# EAGLE design Ivy Sensor Shield (EAGLE 7.2.0)
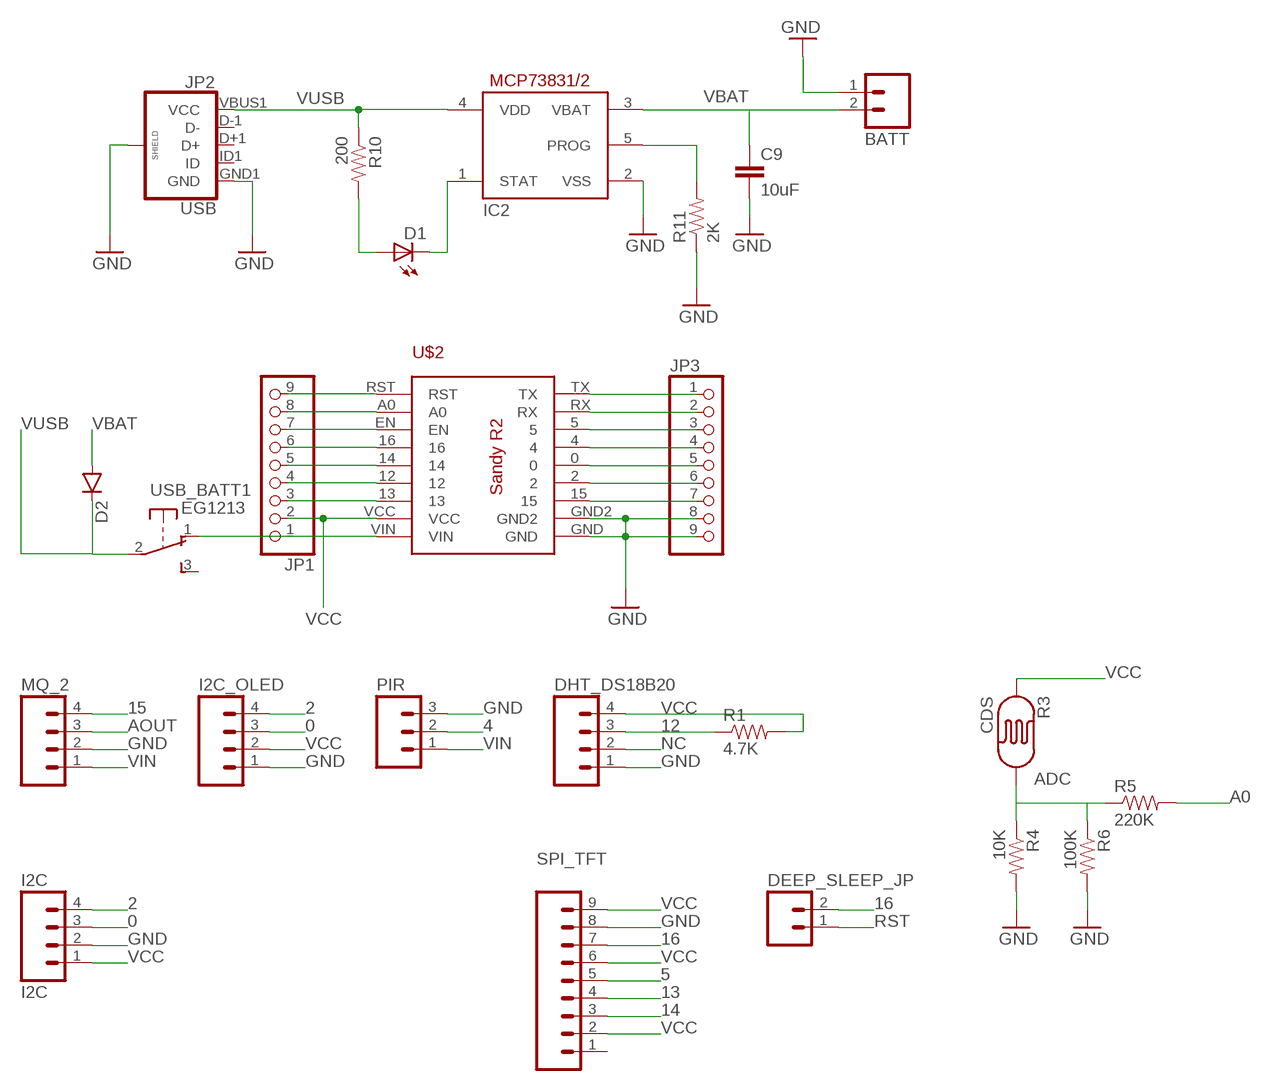
[diagram p0: schematic, sheet 1]

## Parts
BATT  M02PTH  [1X02]
C9  10uF  CAP0805  [0805]
D1  LEDCHIPLED_0805  [CHIPLED_0805]
D2  DIODESOD123  [SOD-123]
DEEP_SLEEP_JP  M02PTH  [1X02]
DHT_DS18B20  M04PTH  [1X04]
I2C  I2C  M04PTH  [1X04]
I2C_OLED  M04PTH  [1X04]
IC2  MCP73831/OT  [SOT23-5L]
JP1  PINHD-1X9  [1X09-BIG]
JP2  USB  USB_MICROB_PLUGCONN-11752  [USB-B-MICRO-SMD_V03]
JP3  PINHD-1X9  [1X09-BIG]
MQ_2  M04PTH  [1X04]
PIR  M03PTH  [1X03]
R1  4.7K  RESISTOR0805-RES  [0805]
R3  CDS  PHOTOCELL  [PHOTOCELL_THIN]
R4  10K  RESISTOR0805-RES  [0805]
R5  220K  RESISTOR0805-RES  [0805]
R6  100K  RESISTOR0805-RES  [0805]
R10  200  RESISTOR0805-RES  [0805]
R11  2K  RESISTOR0805-RES  [0805]
SPI_TFT  M09  [1X09]
U$2  MINI-ESPMINI-ESP-LOCK  [MINI-ESP-LOCK]
USB_BATT  EG1213  [EG1213]

## Nets
0: I2C.3 I2C_OLED.3 JP3.5 U$2.0
2: I2C.4 I2C_OLED.4 JP3.6 U$2.2
4: JP3.4 PIR.2 U$2.4
5: JP3.3 SPI_TFT.5 U$2.5
12: DHT_DS18B20.3 JP1.4 R1.1 U$2.12
13: JP1.3 SPI_TFT.4 U$2.13
14: JP1.5 SPI_TFT.3 U$2.14
15: JP3.7 MQ_2.4 U$2.15
16: DEEP_SLEEP_JP.2 JP1.6 SPI_TFT.7 U$2.16
A0: JP1.8 R5.2 U$2.A0
ADC: R3.2 R4.1 R5.1 R6.1
AOUT: MQ_2.3
EN: JP1.7 U$2.EN
GND: BATT.1 C9.2 DHT_DS18B20.1 I2C.2 I2C_OLED.1 IC2.2(VSS) JP2.GND1(GND) JP2.SHIELD1(SHIELD) JP2.SHIELD2(SHIELD) JP2.SHIELD3(SHIELD) JP3.8 JP3.9 MQ_2.2 PIR.3 R4.2 R6.2 R11.1 SPI_TFT.8 U$2.GND U$2.GND2
N$3: D1.A R10.2
NC: DHT_DS18B20.2
PROG: IC2.5(PROG) R11.2
RST: DEEP_SLEEP_JP.1 JP1.9 U$2.RST
RX: JP3.2 U$2.RX
STAT: D1.C IC2.1(STAT)
TX: JP3.1 U$2.TX
VBAT: BATT.2 C9.1 D2.A IC2.3(VBAT)
VCC: DHT_DS18B20.4 I2C.1 I2C_OLED.2 JP1.2 R1.2 R3.1 SPI_TFT.2 SPI_TFT.6 SPI_TFT.9 U$2.VCC
VIN: JP1.1 MQ_2.1 PIR.1 U$2.VIN USB_BATT.1(1:O)
VUSB: D2.C IC2.4(VDD) JP2.VBUS1(VCC) R10.1 USB_BATT.2(1:P)
Unconnected: JP2.D+1(D+) JP2.D-1(D-) JP2.ID1(ID) SPI_TFT.1 USB_BATT.3(1:S) USB_BATT.MT1(MT) USB_BATT.MT2(MT)

## Library data of the parts
BATT DEEP_SLEEP_JP = SparkFun-Connectors:M02: Standard 2-pin 0.1" header. Use with - straight break away headers ( PRT-00116) - right angle break away headers (PRT-00553) - swiss pins (PRT-00743) - machine pins (PRT-00117) - female headers (PRT-00115) Molex polarized connector foot print use with: PRT-08233 with associated crimp pins and housings. 2.54_SCREWTERM for use with PRT-10571. 3.5mm Screw Terminal footprints for PRT-08084 5mm Screw Terminal footprints for use with PRT-08432
C9 = SparkFun-Passives:CAP: Capacitor Standard 0603 ceramic capacitor, and 0.1" leaded capacitor.
D1 = adafruit:LED: LED OSRAM: - CHIPLED LG R971, LG N971, LY N971, LG Q971, LY Q971, LO R971, LY R971 LH N974, LH R974 LS Q976, LO Q976, LY Q976 LO Q996 - Hyper CHIPLED LW Q18S LB Q993, LB Q99A, LB R99A - SideLED LS A670, LO A670, LY A670, LG A670, LP A670 LB A673, LV A673, LT A673, LW A673 LH A674 LY A675 LS A676, LA A676, LO A676, LY A676, LW A676 LS A679, LY A679, LG A679 - Hyper Micro SIDELED® LS Y876, LA Y876, LO Y876, LY Y876 LT Y87S - SmartLED LW L88C, LW L88S LB L89C, LB L89S, LG L890 LS L89K, LO L89K, LY L89K LS L896, LA L896, LO L896, LY L896 - TOPLED LS T670, LO T670, LY T670, LG T670, LP T670 LSG T670, LSP T670, LSY T670, LOP T670, LYG T670 LG T671, LOG T671, LSG T671 LB T673, LV T673, LT T673, LW T673 LH T674 LS T676, LA T676, LO T676, LY T676, LB T676, LH T676, LSB T676, LW T676 LB T67C, LV T67C, LT T67C, LS T67K, LO T67K, LY T67K, LW E67C LS E67B, LA E67B, LO E67B, LY E67B, LB E67C, LV E67C, LT E67C LW T67C LS T679, LY T679, LG T679 LS T770, LO T770, LY T770, LG T770, LP T770 LB T773, LV T773, LT T773, LW T773 LH T774 LS E675, LA E675, LY E675, LS T675 LS T776, LA T776, LO T776, LY T776, LB T776 LHGB T686 LT T68C, LB T68C - Hyper Mini TOPLED® LB M676 - Mini TOPLED Santana® LG M470 LS M47K, LO M47K, LY M47K Source: http://www.osram.convergy.de/
D2 = SparkFun-DiscreteSemi:DIODE: Diode These are standard reverse protection diodes and small signal diodes. SMA package can handle up to about 1A. SOD-323 can handle about 200mA. What the SOD-323 package when ordering, there are some mfgs out there that are 5-pin packages.
DHT_DS18B20 I2C I2C_OLED MQ_2 = SparkFun-Connectors:M04: Header 4 Standard 4-pin 0.1" header. Use with straight break away headers (SKU : PRT-00116), right angle break away headers (PRT-00553), swiss pins (PRT-00743), machine pins (PRT-00117), and female headers (PRT-00115). Molex polarized connector foot print use with SKU : PRT-08231 with associated crimp pins and housings. 1MM SMD Version SKU: PRT-10208
IC2 = adafruit:MCP73831: MCP73831/2 Miniature Single-Cell, Fully Integrated Li-Ion, Li-Polymer Charge Management Controllers. Nice and small simple lipoly charge controller, with adjustable current and status output (LED) http://www.ladyada.net/library/pcb/eaglelibrary.html
JP1 JP3 = adafruit:PINHD-1X9: Pin header 1x10 0.1" spacing With round pins
JP2 = SparkFun-Connectors:USB_MICROB_PLUG: USB Micro-B connectors Some male, some female. Watch your step!; PROD_ID: CONN-11752
PIR = SparkFun-Connectors:M03: Header 3 Standard 3-pin 0.1" header. Use with straight break away headers (SKU : PRT-00116), right angle break away headers (PRT-00553), swiss pins (PRT-00743), machine pins (PRT-00117), and female headers (PRT-00115). Molex polarized connector foot print use with SKU : PRT-08232 with associated crimp pins and housings.
R1 R4-R6 R10 R11 = SparkFun-Passives:RESISTOR: Resistor Basic schematic elements and footprints for 0603, 1206, and PTH resistors.
R3 = SparkFun-Sensors:PHOTOCELL: CdS photoresistor. This is a low cost way to detect light levels. Resistance decreases with more incoming light. SparkFun SKU: SEN-09088
SPI_TFT = SparkFun-Connectors:M09: Header 9 Standard 9-pin 0.1" header. Use with straight break away headers (SKU : PRT-00116), right angle break away headers (PRT-00553), swiss pins (PRT-00743), machine pins (PRT-00117), and female headers (PRT-00115).
U$2 = My Eagle Lib:MINI-ESP
USB_BATT = adafruit:EG1213: E-Switch right-angle slide SPDT Part #EG1213 http://www.ladyada.net/library/eagle

## Board
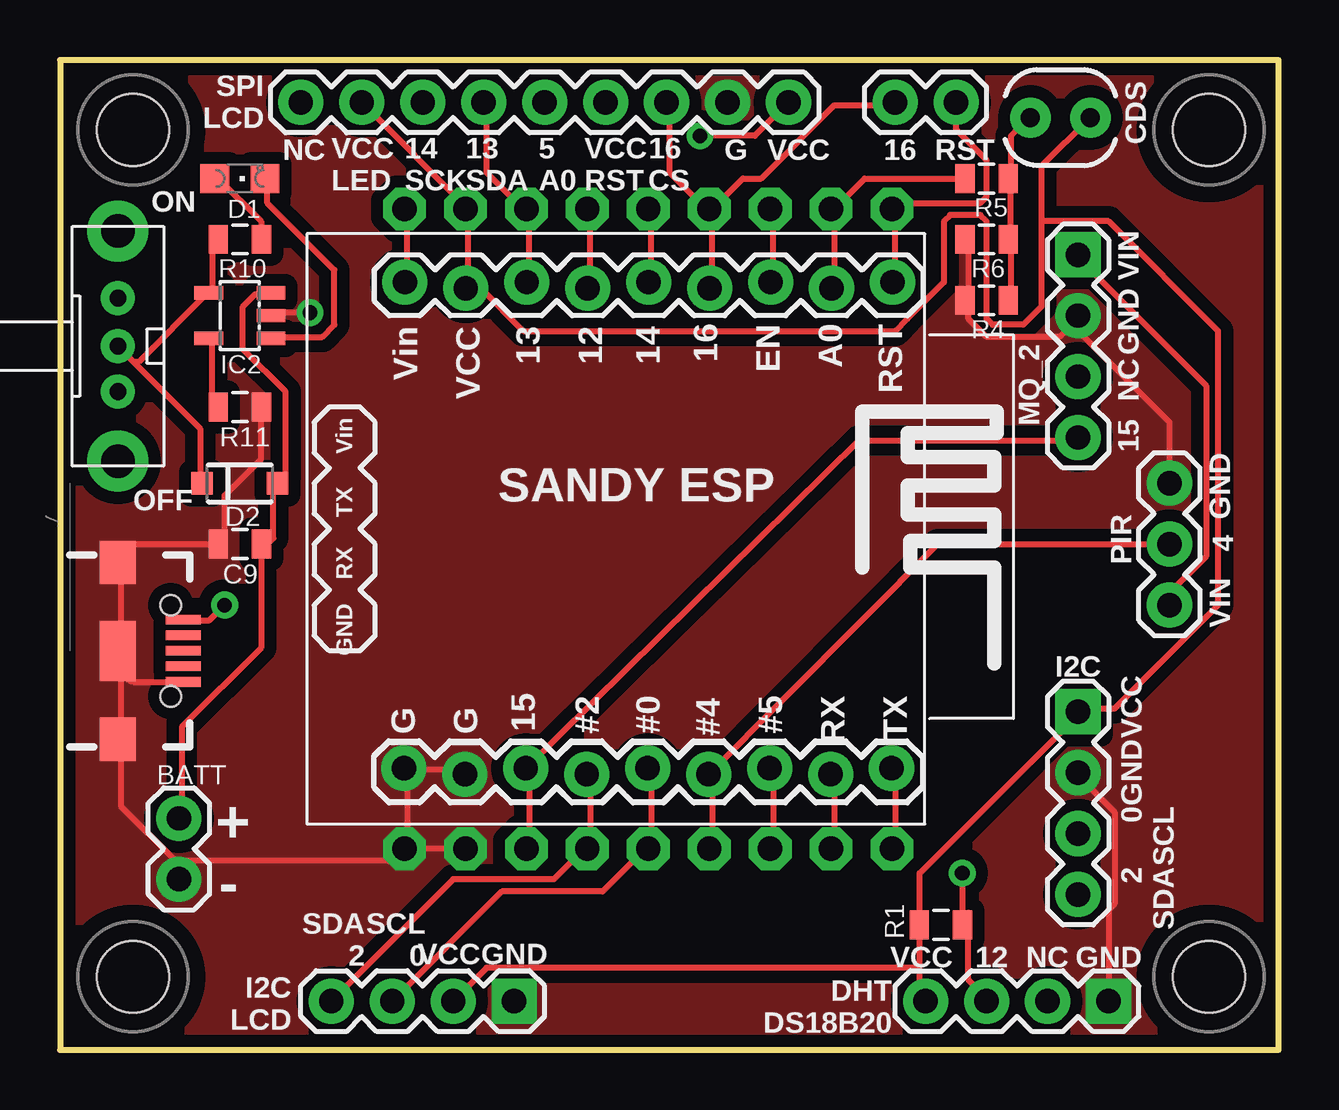
[diagram p1: board, top side]
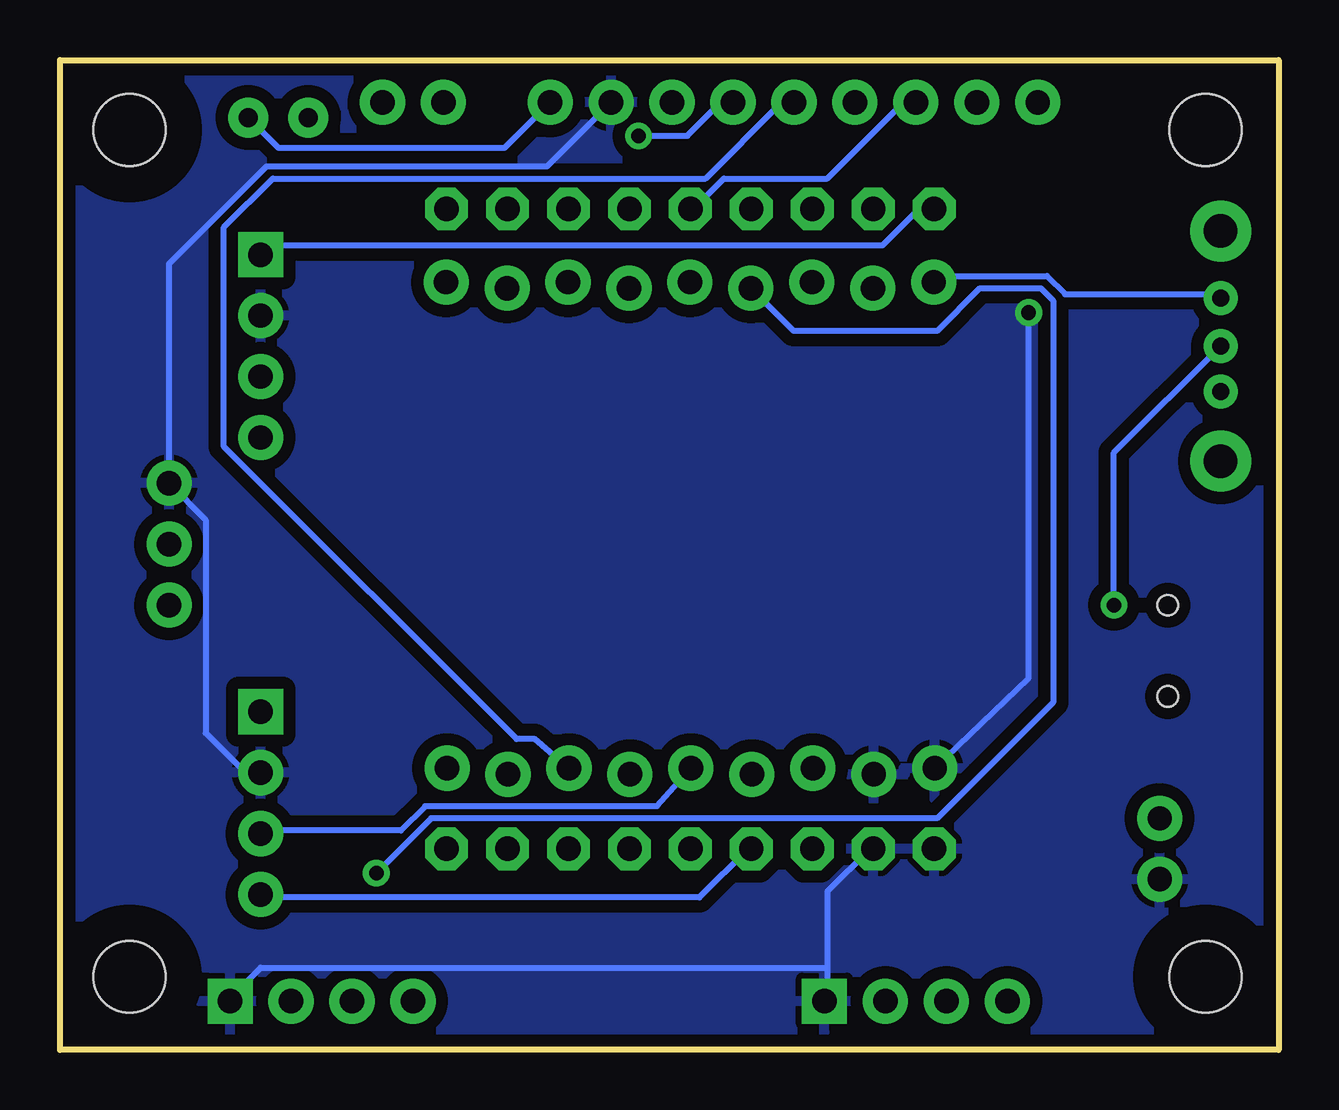
[diagram p2: board, bottom side, seen from below]

Size 50.77 x 41.26 mm. Coordinates in mm from the lower left corner, seen from the top.
Outline: 0,0 50.77,0 50.77,41.26 0,41.26 0,0
Copper layers (1*16): Top 0.035mm / dielectric 1.5mm / Bottom 0.035mm
Design rules "default *": minimum track width 10mil, minimum drill 24mil, track to track 10mil, track to pad 10mil, pad to pad 10mil, via to via 10mil, smd to smd 8mil, copper to edge 20mil, drill to drill 12mil, minimum pad ring 13mil, minimum via ring 10mil, stop-mask expansion 4mil, vias tented up to drill 0mil, thermal gap 10mil

### Footprints (pad centres in the part's own frame; a part is rotated, then mirrored left to right if it is on the bottom)
1X02 = drill 1.016 pad 1.88: 1 0,0; 2 2.54,0
0805 = smd 0.8 x 1.2: 1 -0.9,0; 2 0.9,0
CHIPLED_0805 = smd 1.2 x 1.2: A 0,-1.05; C 0,1.05
SOD-123 = smd 0.9 x 0.95: A 1.575,0; C -1.575,0
1X04 = drill 1.016 pad 1.88 square: 1 0,0 | drill 1.016 pad 1.88: 2 2.54,0; 3 5.08,0; 4 7.62,0
SOT23-5L = smd 0.55 x 1.2: 1 -0.95,-1.3; 2 0,-1.3; 3 0.95,-1.3; 4 0.95,1.3; 5 -0.95,1.3
1X09-BIG = drill 1.016 pad 1.778 octagon: 1 -10.16,0; 2 -7.62,0; 3 -5.08,0; 4 -2.54,0; 5 0,0; 6 2.54,0; 7 5.08,0; 8 7.62,0; 9 10.16,0
USB-B-MICRO-SMD_V03 = smd 1.45 x 0.4: D+1 2.725,0; D-1 2.725,0.65; GND1 2.725,-1.3; ID1 2.725,-0.65; VBUS1 2.725,1.3 | smd 1.5 x 1.8: SHIELD1 0,3.685; SHIELD2 0,-3.685 | smd 1.5 x 2.5: SHIELD3 0,0 | hole 0.85: 2.2,1.9; 2.2,-1.9
1X03 = drill 1.016 pad 1.88: 1 0,0; 2 2.54,0; 3 5.08,0
PHOTOCELL_THIN = drill 0.8 pad 1.676: 1 -1.15,0; 2 1.35,0
1X09 = drill 1.016 pad 1.88: 1 0,0; 2 2.54,0; 3 5.08,0; 4 7.62,0; 5 10.16,0; 6 12.7,0; 7 15.24,0; 8 17.78,0; 9 20.32,0
MINI-ESP-LOCK = drill 1.016 pad 1.88: 0 9.973,1.5; 2 10.227,-1.04; 4 10.227,4.04; 5 9.973,6.58; 12 -10.033,-1; 13 -10.287,-3.54; 14 -10.287,1.54; 15 9.973,-3.58; 16 -10.033,4.08; A0 -10.033,9.16; EN -10.287,6.62; GND 9.973,-8.66; GND2 10.227,-6.12; RST -10.287,11.7; RX 10.227,9.12; TX 9.973,11.66; VCC -10.033,-6.08; VIN -10.287,-8.62
KFH-M3 = hole 3: 0,0
EG1213 = drill 0.7 pad 1.422: 1 -2,0; 2 0,0; 3 1.9,0 | drill 1.4 pad 2.54: MT1 -4.8,0; MT2 4.8,0

### Placement (x,y rotation side)
BATT  4.95,7.11 90 top
C9  7.49,21.08 180 top
D1  7.49,36.32 270 top
D2  7.49,23.62 0 top
DEEP_SLEEP_JP  37.34,39.5 180 top
DHT_DS18B20  43.69,2.03 180 top
I2C  42.42,14.1 270 top
I2C_OLED  18.92,2.03 180 top
IC2  7.49,30.61 90 top
JP1  24.51,35.05 0 top
JP2  2.41,16.64 0 top
JP3  24.51,8.38 180 top
MQ_2  42.42,33.15 270 top
PIR  46.23,18.54 90 top
R1  36.7,5.21 180 top
R3  41.78,38.86 180 top
R4  38.61,31.24 180 top
R5  38.61,36.32 180 top
R6  38.61,33.78 180 top
R10  7.49,33.78 0 top
R11  7.49,26.8 180 top
SPI_TFT  10.03,39.5 0 top
U$2  22.99,21.72 270 top
U$6  [KFH-M3]  3.05,3.05 0 top
U$7  [KFH-M3]  47.88,3.05 0 top
U$8  [KFH-M3]  47.88,38.35 0 top
U$9  [KFH-M3]  3.05,38.35 0 top
USB_BATT  2.41,29.34 270 top

### Tracks (layer width: path | path; a pad name or v marks a point on that pad's centre or on a via)
0
  Top 0.254: U$2.0 24.64,11.43 24.64,8.38 JP3.5 24.38,8.38 22.61,6.6 18.41,6.6 I2C_OLED.3
  Bottom 0.254: U$2.0 25.91,10.16 35.56,10.16 36.58,9.14 42.42,9.14 I2C.3
2
  Top 0.254: U$2.2 22.1,11.43 22.1,8.38 JP3.6 21.84,8.38 20.57,7.11 16.38,7.11 I2C_OLED.4
  Bottom 0.254: I2C.4 42.42,6.35 24.13,6.35 22.1,8.38 JP3.6
4
  Top 0.254: JP3.4 27.18,8.38 27.18,11.43 U$2.4 36.58,21.08 PIR.2
5
  Top 0.254: JP3.3 29.72,8.38 29.72,11.43 U$2.5
  Bottom 0.254: U$2.5 30.99,12.95 31.75,12.95 43.94,25.15 43.94,34.29 41.91,36.32 23.88,36.32 20.83,39.37 20.32,39.37 SPI_TFT.5
12  (via drill 0.61)
  Top 0.254: DHT_DS18B20.3 38.61,2.16 37.85,2.92 37.85,5.71 R1.1 37.59,5.33 v37.59,7.37 | JP1.4 22.1,35.05 22.1,32 U$2.12
  Bottom 0.254: v37.59,7.37 35.31,9.65 14.22,9.65 9.4,14.48 9.4,31.24 9.91,31.75 12.45,31.75 14.22,29.97 20.21,29.97 U$2.12
13
  Top 0.254: U$2.13 19.56,32 19.56,35.05 JP1.3 19.3,35.05 17.78,36.58 17.78,39.37 SPI_TFT.4
14
  Top 0.254: JP1.5 24.64,35.05 24.64,32 U$2.14
  Bottom 0.254: SPI_TFT.3 15.24,39.37 15.75,39.37 18.8,36.32 23.11,36.32 24.38,35.05 JP1.5
15
  Top 0.254: JP3.7 19.56,8.38 19.56,11.43 U$2.15 33.27,25.4 42.42,25.4 MQ_2.4
16
  Top 0.254: 27.18,35.05 27.18,32 U$2.16 | SPI_TFT.7 25.4,39.37 25.4,36.58 26.92,35.05 JP1.6 27.18,35.05 | 27.18,35.05 28.45,36.32 29.21,36.32 32.26,39.37 34.8,39.37 DEEP_SLEEP_JP.2
A0
  Top 0.254: R5.2 33.53,36.32 32.26,35.05 | 32.26,35.05 32.26,32 U$2.A0 | 32.26,35.05 JP1.8
ADC
  Top 0.254: 39.62,33.78 39.62,31.24 R4.1 | 39.62,33.78 39.62,36.32 | 39.62,33.78 R6.1 | 39.62,36.32 39.62,38.1 40.39,38.86 R3.2 | 39.62,36.32 R5.1
EN
  Top 0.254: JP1.7 29.72,35.05 29.72,32 U$2.EN
GND  (via drill 0.61)
  Top 0.254: 2.54,15.97 2.54,12.95 JP2.SHIELD2 2.54,12.7 2.54,10.16 4.83,7.87 | R11.1 8.38,26.67 8.38,24.64 6.86,23.11 6.86,21.34 C9.2 3.05,21.08 2.54,20.57 JP2.SHIELD1 2.54,20.32 2.54,16.76 JP2.SHIELD3 2.54,16.51 2.54,15.97 | 4.83,7.87 4.83,7.11 BATT.1 4.83,7.87 | JP3.8 14.48,8.38 | v10.41,30.73 8.89,30.73 IC2.2 | U$2.GND2 16.76,11.68 14.48,11.68 U$2.GND 14.48,11.43 14.48,8.38 | 14.48,8.38 JP3.9 14.22,8.38 13.72,7.87 4.83,7.87 | DHT_DS18B20.1 43.69,5.84 43.94,6.1 43.94,9.91 42.42,11.43 I2C.2 | 37.85,31.24 37.85,33.78 R6.2 | 37.85,31.24 37.85,30.48 38.61,29.72 41.66,29.72 42.16,30.23 | 42.16,30.23 42.42,30.48 MQ_2.2 42.16,30.23 | 37.85,31.24 R4.2 | PIR.3 46.23,26.16 42.16,30.23 | 2.54,15.97 arc90 3.18,15.34 JP2.GND1
  Bottom 0.254: 18.8,3.43 18.8,6.6 17.02,8.38 JP3.8 | 18.8,3.43 18.8,2.16 I2C_OLED.1 | v10.41,30.73 10.41,15.49 U$2.GND | 18.8,3.43 42.42,3.43 43.69,2.16 DHT_DS18B20.1 | I2C.2 43.05,11.56 44.7,13.21 44.7,22.1 PIR.3 46.23,32.77 42.16,36.83 30.48,36.83 SPI_TFT.8
  pour Bottom (isolate 0.508): -5.08,44.2 57.91,44.45 57.91,-3.18 -5.08,-3.43
  pour Top (isolate 0.508, no thermals): -5.08,44.2 57.91,44.45 57.91,-3.18 -5.08,-3.43
N$3
  Top 0.254: R10.2 8.38,34.54 6.6,36.32 D1.A
PROG
  Top 0.254: IC2.5 6.35,29.46 6.35,26.92 R11.2
RST
  Top 0.254: 34.8,35.05 34.8,32 U$2.RST | DEEP_SLEEP_JP.1 37.34,38.35 38.61,37.08 38.61,35.56 38.35,35.31 35.05,35.31 34.8,35.05 | 34.8,35.05 JP1.9
RX
  Top 0.254: JP3.2 32.26,8.38 32.26,11.43 U$2.RX
STAT
  Top 0.254: D1.C 8.64,36.32 8.64,35.31 11.43,32.51 11.43,30.23 10.92,29.72 8.89,29.72 IC2.1
TX
  Top 0.254: JP3.1 34.8,8.38 34.8,11.43 U$2.TX
VBAT
  Top 0.254: IC2.3 8.64,31.5 8.13,31.5 7.62,30.99 7.62,29.21 9.4,27.43 9.4,23.88 9.14,23.62 D2.A 8.89,23.62 8.89,21.34 8.64,21.08 C9.1 8.38,16.76 5.08,13.46 5.08,9.65 BATT.2
VCC  (via drill 0.61)
  Top 0.254: 17.02,35.05 17.02,32 U$2.VCC 17.53,31.75 19.3,29.97 34.8,29.97 35.31,30.48 35.69,30.86 36.83,32 36.83,34.54 37.08,34.8 38.35,34.8 38.61,34.54 38.61,30.48 38.86,30.23 40.13,30.23 40.89,30.99 40.89,34.54 | 17.02,35.05 SPI_TFT.2 | 17.02,35.05 JP1.2 | v26.67,38.1 28.96,38.1 SPI_TFT.9 | 40.89,34.54 40.89,36.83 R3.1 | 35.81,3.43 35.81,2.41 36.07,2.16 DHT_DS18B20.4 | 35.81,3.43 35.81,5.71 R1.2 35.81,5.33 35.81,7.37 42.42,13.97 I2C.1 42.42,14.22 43.94,14.22 48.26,18.54 48.26,29.97 43.69,34.54 40.89,34.54 | I2C_OLED.2 17.78,3.43 35.81,3.43
  Bottom 0.254: SPI_TFT.9 32.26,37.59 41.66,37.59 R3.1 | v26.67,38.1 24.64,38.1 23.37,39.37 22.86,39.37 SPI_TFT.6
VIN
  Top 0.254: JP1.1 14.48,35.05 14.48,32 U$2.VIN | PIR.1 46.23,19.05 47.75,20.57 47.75,27.69 42.42,33.02 MQ_2.1
  Bottom 0.254: U$2.VIN 13.97,32.26 9.65,32.26 8.89,31.5 2.54,31.5 USB_BATT.1 | JP1.1 14.99,35.05 16.51,33.53 41.91,33.53 42.29,33.15 MQ_2.1 42.42,33.27
VUSB  (via drill 0.61)
  Top 0.254: R10.1 6.35,33.78 6.35,31.75 IC2.4 6.1,31.5 3.3,28.7 3.05,28.7 | USB_BATT.2 3.05,28.7 | 3.05,28.7 5.84,25.91 5.84,23.62 D2.C | JP2.VBUS1 arc45 5.21,17.91 6.22,17.91 v6.86,18.54
  Bottom 0.254: v6.86,18.54 6.86,24.89 USB_BATT.2

### Text on the board
tNames: SPI / LCD | 16 | NC | G | VCC | RST | VCC / LED | 14 / SCK | 13 / SDA | 5 / A0 | VCC / RST | 16 / CS | ON | VIN | GND | NC | 15 | GND | OFF | 4 | VIN | VCC | GND | 0 / SCL | + | 2 / SDA | - | SDA / 2 | SCL / 0 | VCC | GND | VCC | 12 | NC | GND | I2C / LCD | DHT / DS18B20